# Altium schematic sheet top-level.SchDoc
size A4; SheetNumber: 2; SheetTotal: 13
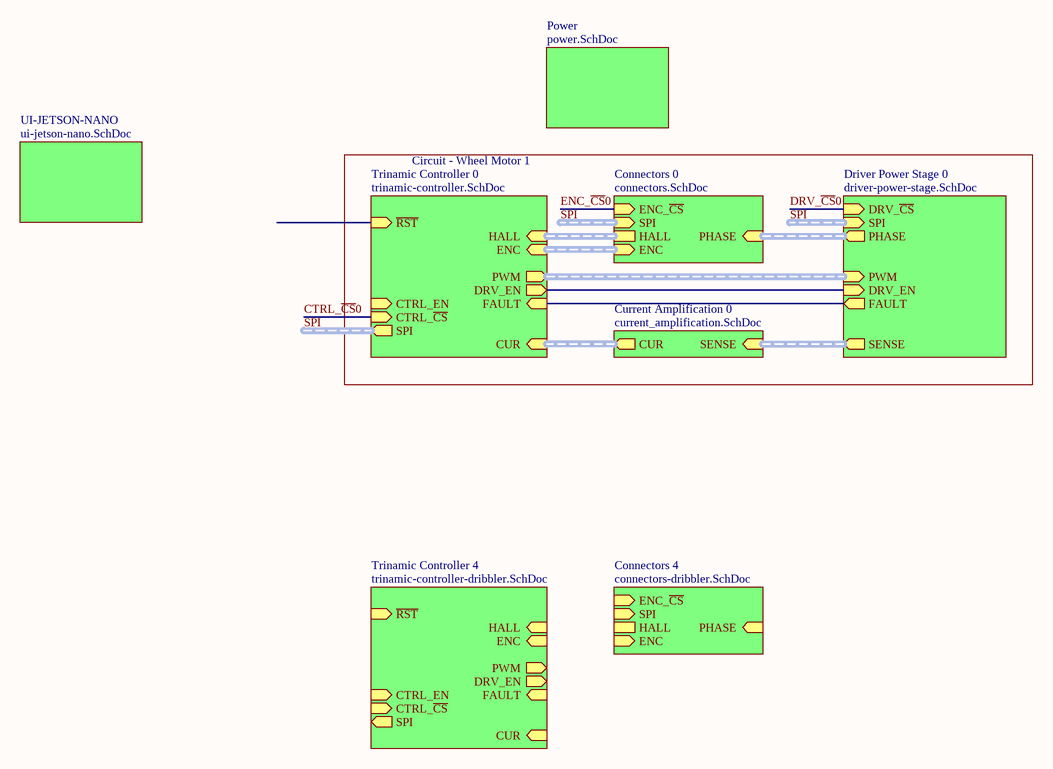
[diagram p0: top-level.SchDoc]

## Sub-sheets
Connectors 0 = connectors.SchDoc: PHASE (in), HALL, ENC (in), SPI (in), ENC_~{CS} (in)
Connectors 4 = connectors-dribbler.SchDoc: PHASE (in), HALL, ENC (in), SPI (in), ENC_~{CS} (in)
Current Amplification 0 = current_amplification.SchDoc: SENSE (in), CUR (out)
Driver Power Stage 0 = driver-power-stage.SchDoc: DRV_EN (in), PWM (in), FAULT (out), SENSE (out), PHASE (out), SPI (in), DRV_~{CS} (in)
Power = power.SchDoc: no entries
Trinamic Controller 0 = trinamic-controller.SchDoc: ~{RST} (in), CUR (in), DRV_EN (out), CTRL_EN (in), PWM (out), HALL (in), FAULT (in), SPI (out), CTRL_~{CS} (in), ENC (in)
Trinamic Controller 4 = trinamic-controller-dribbler.SchDoc: ~{RST} (in), CUR (in), DRV_EN (out), CTRL_EN (in), PWM (out), HALL (in), FAULT (in), SPI (out), CTRL_~{CS} (in), ENC (in)
UI-JETSON-NANO = ui-jetson-nano.SchDoc: no entries

## Nets
CTRL_~{CS}0: sheet Trinamic Controller 0/CTRL_~{CS}
DRV_~{CS}0: sheet Driver Power Stage 0/DRV_~{CS}
ENC_~{CS}0: sheet Connectors 0/ENC_~{CS}
(unnamed): sheet Driver Power Stage 0/DRV_EN, sheet Trinamic Controller 0/DRV_EN
(unnamed): sheet Driver Power Stage 0/FAULT, sheet Trinamic Controller 0/FAULT

## Buses and harness runs
harness sheet Connectors 0/ENC = sheet Trinamic Controller 0/ENC
harness sheet Connectors 0/HALL = sheet Trinamic Controller 0/HALL
harness sheet Connectors 0/PHASE = sheet Driver Power Stage 0/PHASE
harness sheet Current Amplification 0/CUR = sheet Trinamic Controller 0/CUR
harness sheet Current Amplification 0/SENSE = sheet Driver Power Stage 0/SENSE
harness sheet Driver Power Stage 0/PWM = sheet Trinamic Controller 0/PWM
harness SPI = sheet Connectors 0/SPI
harness SPI = sheet Driver Power Stage 0/SPI
harness SPI = sheet Trinamic Controller 0/SPI

## Notes on the sheet
- Circuit - Wheel Motor 1